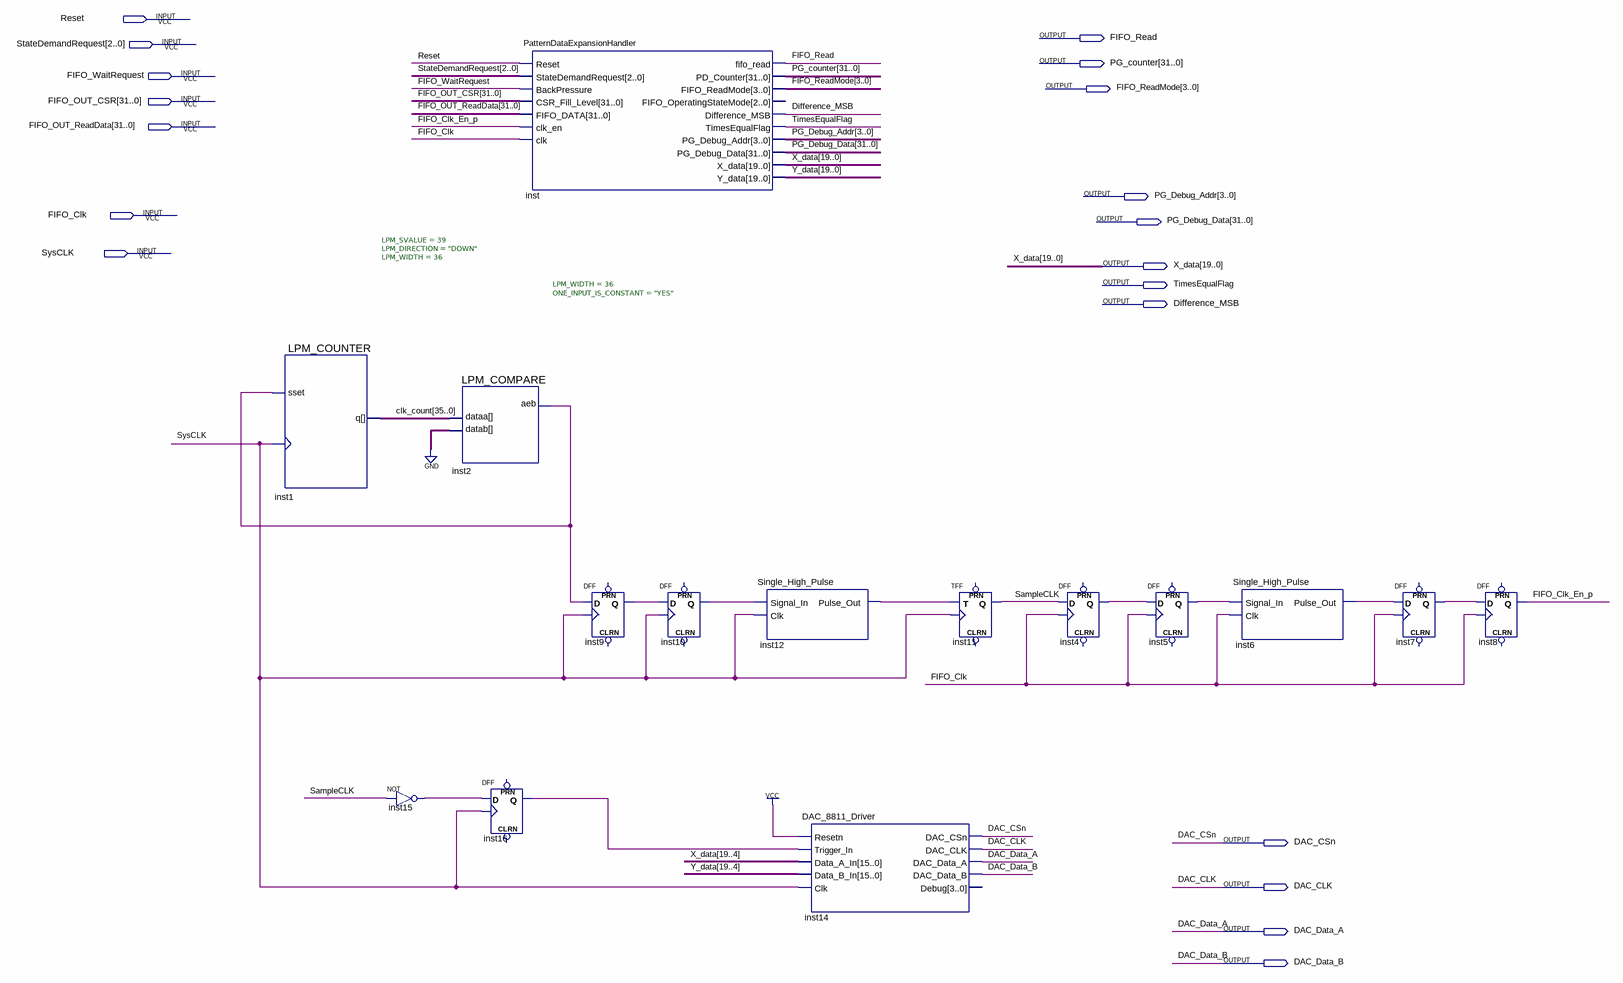
[diagram p0: schematic sheet]
// Quartus schematic PatternGeneration.bdf as structural Verilog: 15 symbols, 19 pins
module PatternGeneration (
  input  Reset,
  input  [2:0] StateDemandRequest,
  input  FIFO_WaitRequest,
  input  [31:0] FIFO_OUT_CSR,
  input  [31:0] FIFO_OUT_ReadData,
  input  FIFO_Clk,
  input  SysCLK,
  output FIFO_Read,
  output [31:0] PG_counter,
  output [3:0] FIFO_ReadMode,
  output [3:0] PG_Debug_Addr,
  output [31:0] PG_Debug_Data,
  output [19:0] X_data,
  output TimesEqualFlag,
  output Difference_MSB,
  output DAC_CSn,
  output DAC_CLK,
  output DAC_Data_A,
  output DAC_Data_B
);

  wire FIFO_Clk_En_p, inst2_aeb, inst4_q, inst5_q, inst6_pulse_out, inst7_q, inst9_q, inst10_q,
       inst12_pulse_out, inst15_out, inst16_q, SampleCLK;
  wire [19:0] Y_data;
  wire [35:0] clk_count;

  LPM_COUNTER #(.LPM_SVALUE(39), .LPM_DIRECTION("DOWN"), .LPM_WIDTH(36)) inst1 (
    .clock(SysCLK), .sset(inst2_aeb), .q(clk_count));
  not inst15 (inst15_out, SampleCLK);
  LPM_COMPARE #(.LPM_WIDTH(36), .ONE_INPUT_IS_CONSTANT("YES")) inst2 (
    .dataa(clk_count), .datab({36{1'b0}}), .aeb(inst2_aeb));
  PatternDataExpansionHandler inst (
    .Reset(Reset), .StateDemandRequest(StateDemandRequest), .BackPressure(FIFO_WaitRequest),
    .CSR_Fill_Level(FIFO_OUT_CSR), .FIFO_DATA(FIFO_OUT_ReadData), .clk_en(FIFO_Clk_En_p), .clk(FIFO_Clk),
    .fifo_read(FIFO_Read), .PD_Counter(PG_counter), .FIFO_ReadMode(FIFO_ReadMode),
    .Difference_MSB(Difference_MSB), .TimesEqualFlag(TimesEqualFlag), .PG_Debug_Addr(PG_Debug_Addr),
    .PG_Debug_Data(PG_Debug_Data), .X_data(X_data), .Y_data(Y_data));  // open: FIFO_OperatingStateMode
  DFF inst16 (.CLK(SysCLK), .D(inst15_out), .Q(inst16_q));  // open: CLRN, PRN
  DFF inst9 (.CLK(SysCLK), .D(inst2_aeb), .Q(inst9_q));  // open: CLRN, PRN
  DFF inst10 (.CLK(SysCLK), .D(inst9_q), .Q(inst10_q));  // open: CLRN, PRN
  Single_High_Pulse inst12 (.Signal_In(inst10_q), .Clk(SysCLK), .Pulse_Out(inst12_pulse_out));
  DAC_8811_Driver inst14 (
    .Resetn(1'b1), .Trigger_In(inst16_q), .Data_A_In(X_data[19:4]), .Data_B_In(Y_data[19:4]), .Clk(SysCLK),
    .DAC_CSn(DAC_CSn), .DAC_CLK(DAC_CLK), .DAC_Data_A(DAC_Data_A), .DAC_Data_B(DAC_Data_B));  // open: Debug
  TFF inst11 (.T(inst12_pulse_out), .CLK(SysCLK), .Q(SampleCLK));  // open: PRN, CLRN
  DFF inst4 (.CLK(FIFO_Clk), .D(SampleCLK), .Q(inst4_q));  // open: CLRN, PRN
  DFF inst5 (.CLK(FIFO_Clk), .D(inst4_q), .Q(inst5_q));  // open: CLRN, PRN
  Single_High_Pulse inst6 (.Signal_In(inst5_q), .Clk(FIFO_Clk), .Pulse_Out(inst6_pulse_out));
  DFF inst7 (.CLK(FIFO_Clk), .D(inst6_pulse_out), .Q(inst7_q));  // open: CLRN, PRN
  DFF inst8 (.CLK(FIFO_Clk), .D(inst7_q), .Q(FIFO_Clk_En_p));  // open: CLRN, PRN
endmodule
